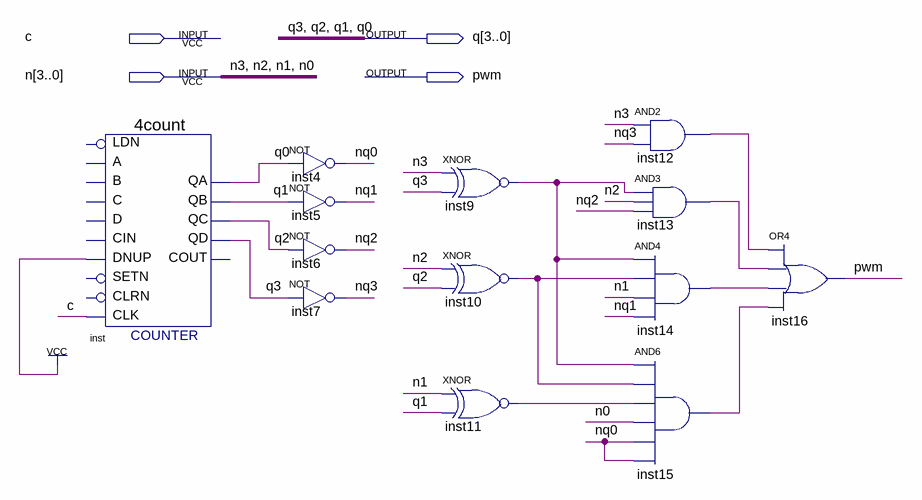
[diagram p0: schematic sheet]
// Quartus schematic s74_pwm_rev.bdf as structural Verilog: 13 symbols, 4 pins
module s74_pwm_rev (
  input  c,
  input  [3:0] n,
  output [3:0] q,
  output pwm
);

  wire inst9_out, inst10_out, inst11_out, inst12_out, inst13_out, inst14_out, inst15_out, nq0, nq1, nq2, nq3;

  \4count  inst (
    .DNUP(1'b1), .CLK(c), .QA(q[0]), .QB(q[1]), .QC(q[2]), .QD(q[3]));  // open: LDN, B, A, D, CIN, SETN, C, CLRN, COUT
  not inst4 (nq0, q[0]);
  not inst5 (nq1, q[1]);
  not inst6 (nq2, q[2]);
  not inst7 (nq3, q[3]);
  xnor inst9 (inst9_out, n[3], q[3]);
  xnor inst10 (inst10_out, n[2], q[2]);
  xnor inst11 (inst11_out, n[1], q[1]);
  and inst12 (inst12_out, n[3], nq3);
  and inst13 (inst13_out, inst9_out, n[2], nq2);
  and inst14 (inst14_out, inst9_out, inst10_out, n[1], nq1);
  and inst15 (inst15_out, inst9_out, inst10_out, inst11_out, n[0], nq0, nq0);
  or inst16 (pwm, inst12_out, inst13_out, inst14_out, inst15_out);
endmodule
